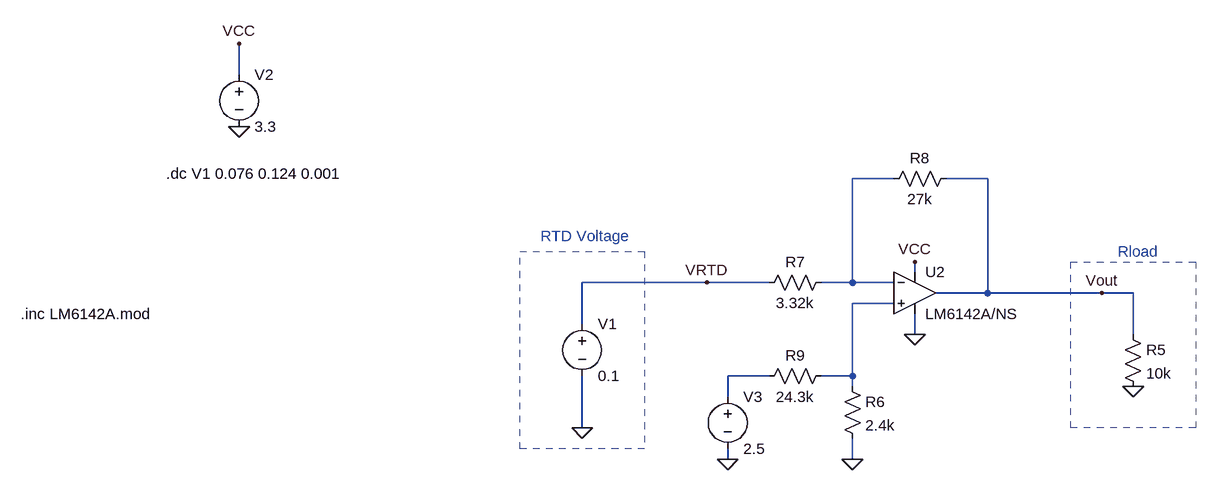
[diagram p0: schematic Flight_RTD2.asc]
Flight_RTD2.asc, the LTspice schematic file:
Version 4
SHEET 1 1364 680
WIRE -112 -304 -112 -352
WIRE 896 -144 832 -144
WIRE 1040 -144 976 -144
WIRE 928 0 928 -16
WIRE 608 16 416 16
WIRE 704 16 608 16
WIRE 832 16 832 -144
WIRE 832 16 784 16
WIRE 896 16 832 16
WIRE 1040 32 1040 -144
WIRE 1040 32 960 32
WIRE 1216 32 1040 32
WIRE 1264 32 1216 32
WIRE 896 48 832 48
WIRE 416 80 416 16
WIRE 928 96 928 64
WIRE 1264 96 1264 32
WIRE 704 160 640 160
WIRE 832 160 832 48
WIRE 832 160 784 160
WIRE 832 176 832 160
WIRE 640 192 640 160
WIRE 416 240 416 160
WIRE 640 288 640 272
WIRE 832 288 832 256
FLAG -112 -224 0
FLAG 416 240 0
FLAG 1264 176 0
FLAG -112 -352 VCC
FLAG 928 -16 VCC
FLAG 928 96 0
FLAG 640 288 0
FLAG 832 288 0
FLAG 608 16 VRTD
FLAG 1216 32 Vout
SYMBOL voltage 416 64 R0
WINDOW 123 0 0 Left 2
WINDOW 39 0 0 Left 2
SYMATTR InstName V1
SYMATTR Value 0.1
SYMBOL voltage -112 -320 R0
WINDOW 123 0 0 Left 2
WINDOW 39 0 0 Left 2
SYMATTR InstName V2
SYMATTR Value 3.3
SYMBOL res 1248 80 R0
SYMATTR InstName R5
SYMATTR Value 10k
SYMBOL Opamps\\opamp2 928 -32 R0
SYMATTR InstName U2
SYMATTR Value LM6142A/NS
SYMBOL res 816 160 R0
SYMATTR InstName R6
SYMATTR Value 2.4k
SYMBOL res 800 0 R90
WINDOW 0 0 56 VBottom 2
WINDOW 3 32 56 VTop 2
SYMATTR InstName R7
SYMATTR Value 3.32k
SYMBOL res 992 -160 R90
WINDOW 0 0 56 VBottom 2
WINDOW 3 32 56 VTop 2
SYMATTR InstName R8
SYMATTR Value 27k
SYMBOL res 800 144 R90
WINDOW 0 0 56 VBottom 2
WINDOW 3 32 56 VTop 2
SYMATTR InstName R9
SYMATTR Value 24.3k
SYMBOL voltage 640 176 R0
WINDOW 123 0 0 Left 2
WINDOW 39 0 0 Left 2
SYMATTR InstName V3
SYMATTR Value 2.5
TEXT -224 -152 Left 2 !.dc V1 0.076 0.124 0.001
TEXT -448 64 Left 2 !.inc LM6142A.mod
TEXT 1240 -32 Left 2 ;Rload
TEXT 352 -56 Left 2 ;RTD Voltage
RECTANGLE Normal 1360 240 1168 -16 2
RECTANGLE Normal 512 272 320 -32 2

The netlist it stands for:
* Flight_RTD2.asc
V1 VRTD 0 0.1
V2 VCC 0 3.3
R5 Vout 0 10k
XU2 N002 N001 VCC 0 Vout LM6142A/NS  ; pins In+ In- V+ V- OUT
R6 N002 0 2.4k
R7 N001 VRTD 3.32k
R8 Vout N001 27k
R9 N002 N003 24.3k
V3 N003 0 2.5
.dc V1 0.076 0.124 0.001
.inc LM6142A.mod
* Rload
* RTD Voltage
.backanno
.end